# EAGLE design ESPBoost (EAGLE 9.6.1)
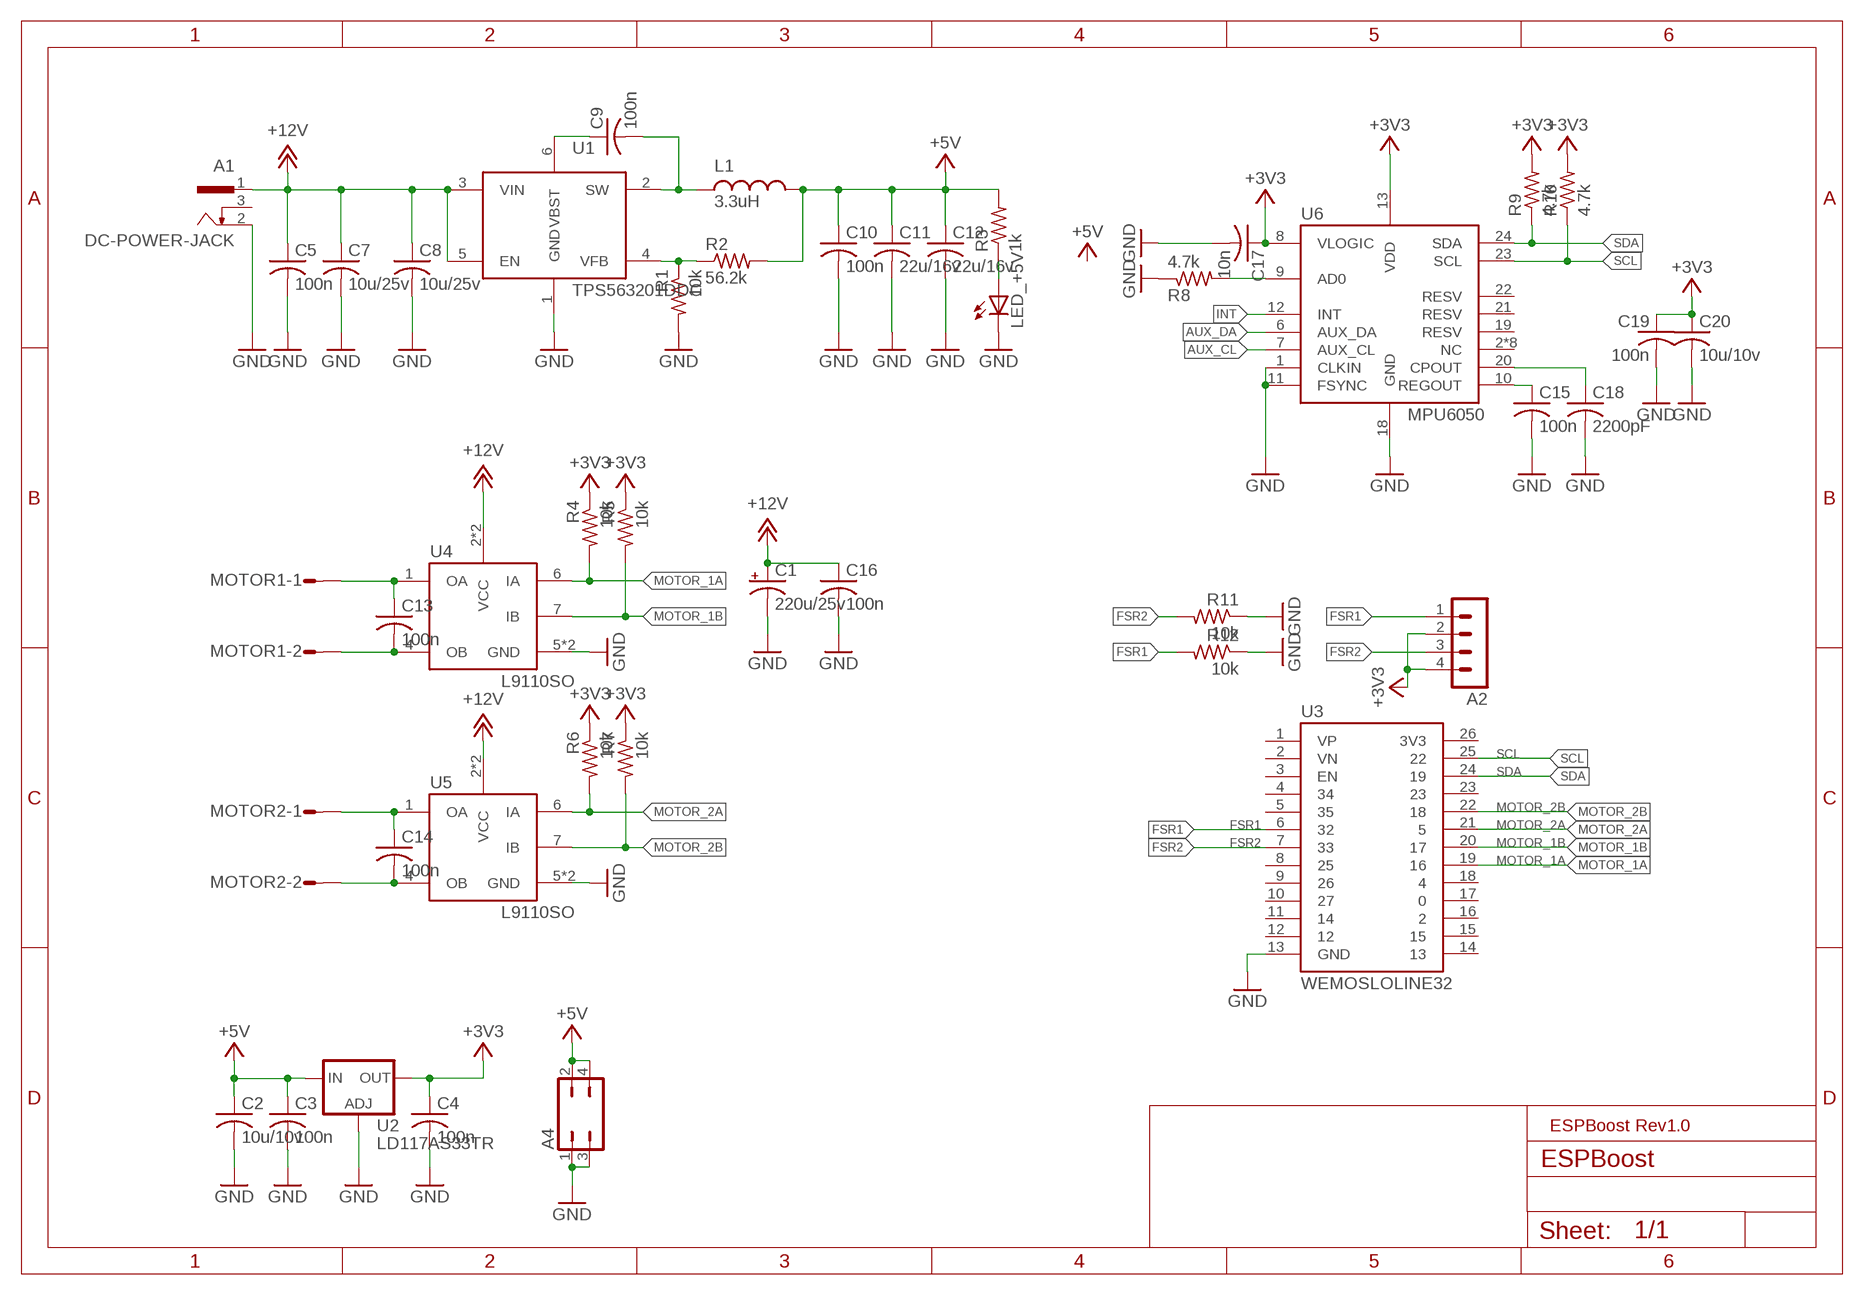
[diagram p0: schematic, sheet 1]

## Parts
A1  DC-POWER-JACK  [DC-POWER]
A2  MA04-1  [MA04-1]
A4  JP2Q  [JP2Q]
C1  220u/25v  CPOL-USE3.5-8  [E3,5-8]
C2  10u/10v  C-USC0805  [C0805]
C3  100n  C-USC0805  [C0805]
C4  100n  C-USC0805  [C0805]
C5  100n  C-USC0805  [C0805]
C7  10u/25v  C-USC1206  [C1206]
C8  10u/25v  C-USC1206  [C1206]
C9  100n  C-USC0805  [C0805]
C10  100n  C-USC0805  [C0805]
C11  22u/16v  C-USC1206  [C1206]
C12  22u/16v  C-USC1206  [C1206]
C13  100n  C-USC0805  [C0805]
C14  100n  C-USC0805  [C0805]
C15  100n  C-USC0805  [C0805]
C16  100n  C-USC0805  [C0805]
C17  10n  C-USC0805  [C0805]
C18  2200pF  C-USC0805  [C0805]
C19  100n  C-USC0805  [C0805]
C20  10u/10v  C-USC0805  [C0805]
L1  3.3uH  SL7032  [SLF7032TYPE]
LED_+5V  LEDCHIPLED_0805  [CHIPLED_0805]
MOTOR1  S02P  [S02P]
MOTOR2  S02P  [S02P]
R1  10k  R-US_R0805  [R0805]
R2  56.2k  R-US_R0805  [R0805]
R3  1k  R-US_R0805  [R0805]
R4  10k  R-US_R0805  [R0805]
R5  10k  R-US_R0805  [R0805]
R6  10k  R-US_R0805  [R0805]
R7  10k  R-US_R0805  [R0805]
R8  4.7k  R-US_R0805  [R0805]
R9  4.7k  R-US_R0805  [R0805]
R10  4.7k  R-US_R0805  [R0805]
R11  10k  R-US_R0805  [R0805]
R12  10k  R-US_R0805  [R0805]
U1  TPS563201DDC  [SOT23-6L]
U2  LD117AS33TR  [SOT223]
U3  WEMOSLOLINE32  [WEMOSLOLIN32]
U4  L9110SO  [SO08]
U5  L9110SO  [SO08]
U6  MPU6050  [QFN24]

## Nets
+3V3 [16mil]: A2.2 A2.4 C4.1 C17.1 C19.1 C20.1 R4.1 R5.1 R6.1 R7.1 R9.2 R10.2 U2.4(OUT) U6.8(VLOGIC) U6.13(VDD)
+5V [32mil]: A4.2 A4.4 C2.1 C3.1 C10.1 C11.1 C12.1 L1.2 R2.2 R3.2 U2.3(IN)
+12V [32mil]: A1.1 C1.+ C5.1 C7.1 C8.1 C16.1 U1.3(VIN) U1.5(EN) U4.2(VCC) U4.3(VCC) U5.2(VCC) U5.3(VCC)
AUX_CL: U6.7(AUX_CL)
AUX_DA: U6.6(AUX_DA)
FSR1: A2.1 R12.2 U3.6
FSR2: A2.3 R11.2 U3.7
GND: A1.2 A4.1 A4.3 C1.- C2.2 C3.2 C4.2 C5.2 C7.2 C8.2 C10.2 C11.2 C12.2 C15.2 C16.2 C17.2 C18.2 C19.2 C20.2 LED_+5V.C R1.2 R8.1 R11.1 R12.1 U1.1(GND) U2.1(ADJ) U3.13(GND) U4.5(GND) U4.8(GND) U5.5(GND) U5.8(GND) U6.1(CLKIN) U6.11(FSYNC) U6.18(GND)
INT: U6.12(INT)
MOTOR_1A: R4.2 U3.19 U4.6(IA)
MOTOR_1B: R5.2 U3.20 U4.7(IB)
MOTOR_1OA: C13.1 MOTOR1.1 U4.1(OA)
MOTOR_1OB: C13.2 MOTOR1.2 U4.4(OB)
MOTOR_2A: R6.2 U3.21 U5.6(IA)
MOTOR_2B: R7.2 U3.22 U5.7(IB)
MOTOR_2OA: C14.1 MOTOR2.1 U5.1(OA)
MOTOR_2OB: C14.2 MOTOR2.2 U5.4(OB)
N$19: LED_+5V.A R3.1
N$23: C9.2 L1.1 U1.2(SW)
N$25: R1.1 R2.1 U1.4(VFB)
N$27: C9.1 U1.6(VBST)
N$31: R8.2 U6.9(AD0)
N$32: C15.1 U6.10(REGOUT)
N$33: C18.1 U6.20(CPOUT)
SCL: R10.1 U3.25 U6.23(SCL)
SDA: R9.1 U3.24 U6.24(SDA)
Unconnected: A1.3 U3.1(VP) U3.2(VN) U3.3(EN) U3.4 U3.5 U3.8 U3.9 U3.10 U3.11 U3.12 U3.14 U3.15 U3.16 U3.17 U3.18 U3.23 U3.26(3V3) U6.2(NC) U6.3(NC) U6.4(NC) U6.5(NC) U6.14(NC) U6.15(NC) U6.16(NC) U6.17(NC) U6.19(RESV) U6.21(RESV) U6.22(RESV)

## Notes on the sheet
- ESPBoost Rev1.0

## Library data of the parts
A1 = mylib:DC-POWER-JACK
A2 = mylib:MA04-1: PIN HEADER; OC_FARNELL: unknown; OC_NEWARK: unknown
A4 = jumper:JP2Q: JUMPER
C1 = rcl:CPOL-US: POLARIZED CAPACITOR, American symbol; SPICEPREFIX: C
C2-C5 C7-C20 = rcl:C-US: CAPACITOR, American symbol; SPICEPREFIX: C
L1 = mylib:SL7032
LED_+5V = led:LED: LED OSRAM: - CHIPLED LG R971, LG N971, LY N971, LG Q971, LY Q971, LO R971, LY R971 LH N974, LH R974 LS Q976, LO Q976, LY Q976 LO Q996 - Hyper CHIPLED LW Q18S LB Q993, LB Q99A, LB R99A - SideLED LS A670, LO A670, LY A670, LG A670, LP A670 LB A673, LV A673, LT A673, LW A673 LH A674 LY A675 LS A676, LA A676, LO A676, LY A676, LW A676 LS A679, LY A679, LG A679 - Hyper Micro SIDELED® LS Y876, LA Y876, LO Y876, LY Y876 LT Y87S - SmartLED LW L88C, LW L88S LB L89C, LB L89S, LG L890 LS L89K, LO L89K, LY L89K LS L896, LA L896, LO L896, LY L896 - TOPLED LS T670, LO T670, LY T670, LG T670, LP T670 LSG T670, LSP T670, LSY T670, LOP T670, LYG T670 LG T671, LOG T671, LSG T671 LB T673, LV T673, LT T673, LW T673 LH T674 LS T676, LA T676, LO T676, LY T676, LB T676, LH T676, LSB T676, LW T676 LB T67C, LV T67C, LT T67C, LS T67K, LO T67K, LY T67K, LW E67C LS E67B, LA E67B, LO E67B, LY E67B, LB E67C, LV E67C, LT E67C LW T67C LS T679, LY T679, LG T679 LS T770, LO T770, LY T770, LG T770, LP T770 LB T773, LV T773, LT T773, LW T773 LH T774 LS E675, LA E675, LY E675, LS T675 LS T776, LA T776, LO T776, LY T776, LB T776 LHGB T686 LT T68C, LB T68C - Hyper Mini TOPLED® LB M676 - Mini TOPLED Santana® LG M470 LS M47K, LO M47K, LY M47K Source: http://www.osram.convergy.de LUXEON: - LUMILED® LXK2-PW12-R00, LXK2-PW12-S00, LXK2-PW14-U00, LXK2-PW14-V00 LXK2-PM12-R00, LXK2-PM12-S00, LXK2-PM14-U00 LXK2-PE12-Q00, LXK2-PE12-R00, LXK2-PE12-S00, LXK2-PE14-T00, LXK2-PE14-U00 LXK2-PB12-K00, LXK2-PB12-L00, LXK2-PB12-M00, LXK2-PB14-N00, LXK2-PB14-P00, LXK2-PB14-Q00 LXK2-PR12-L00, LXK2-PR12-M00, LXK2-PR14-Q00, LXK2-PR14-R00 LXK2-PD12-Q00, LXK2-PD12-R00, LXK2-PD12-S00 LXK2-PH12-R00, LXK2-PH12-S00 LXK2-PL12-P00, LXK2-PL12-Q00, LXK2-PL12-R00 Source: www.luxeon.com KINGBRIGHT: KA-3528ASYC Source: www.kingbright.com
MOTOR1 MOTOR2 = con-amp-mt:S02P: AMP MT CONNECTOR; OC_FARNELL: unknown; OC_NEWARK: unknown
R1-R12 = rcl:R-US_: RESISTOR, American symbol; SPICEPREFIX: R
U1 = mylib:TPS563201: TPS56320x 采用6引脚SOT-23 封装的4.5V 至17V 输入、3A 同步降压稳压器 TPS56220x 采用6引脚SOT-23 封装的4.5V 至17V 输入、2A 同步降压稳压器 二者pin对pin，仅仅输出电流不一致。
U2 = v-reg:LD117A?*: Low drop fixed and adjustable positive voltage regulators 1 A Source: http://www.st.com/stonline/products/literature/ds/7194/ld1117axx.pdf
U3 = mylib:WEMOSLOLINE32: ESP32开发测试模块WEMOSLOLINE32LITE
U4 U5 = mylib:L9110: L9110B 是为控制和驱动电机设计的两通道 推挽式功率放大专用集成电路器件,每通道能通过750~800mA 的持续电流，峰值电流能力可达1.5~2.0A
U6 = mylib:MPU6050

## Net classes
0 12mil: width 0.305 mm, drill 0.3 mm, clearance 0.203 mm
1 32mil: width 0.813 mm, drill 0.5 mm, clearance 0.203 mm
2 10mil: width 0.254 mm, drill 0.3 mm, clearance 0.203 mm
3 16mil: width 0.406 mm, drill 0.3 mm, clearance 0.203 mm
4 24mil: width 0.61 mm, drill 0.4 mm, clearance 0.203 mm

## Board
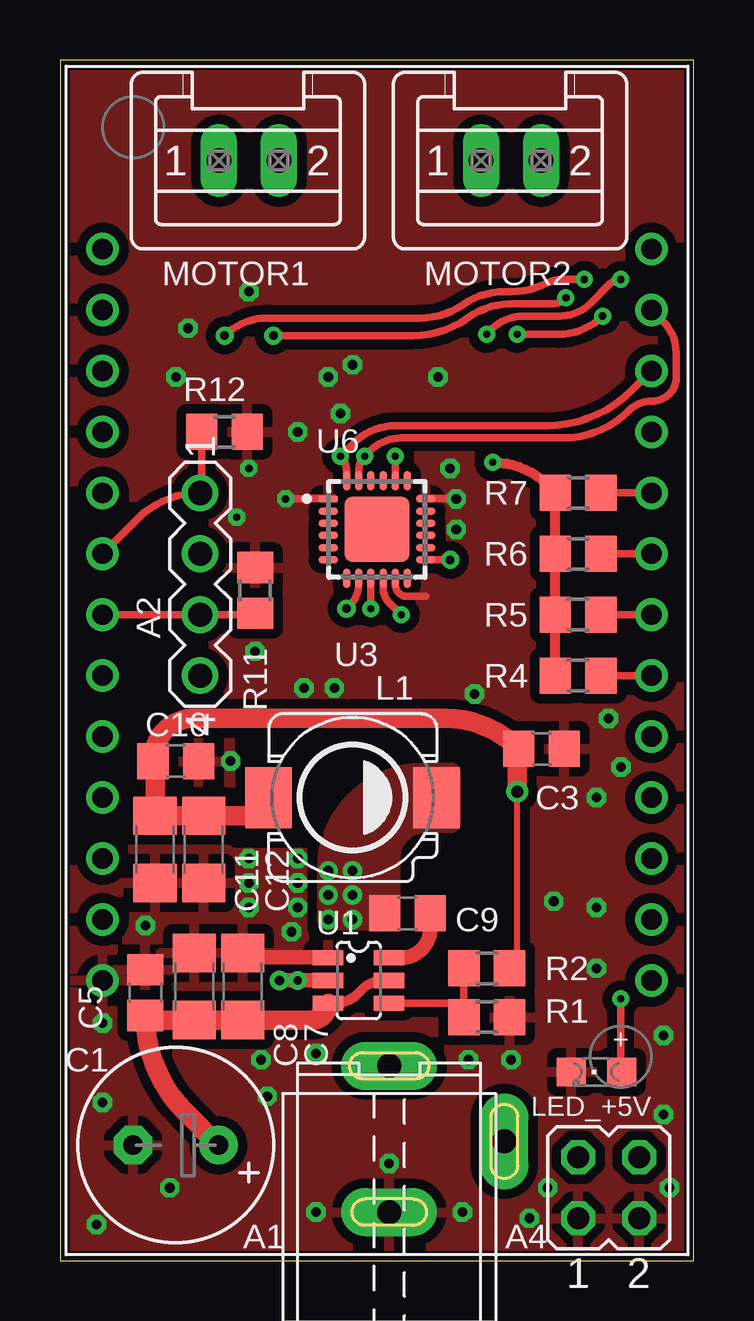
[diagram p1: board, top side]
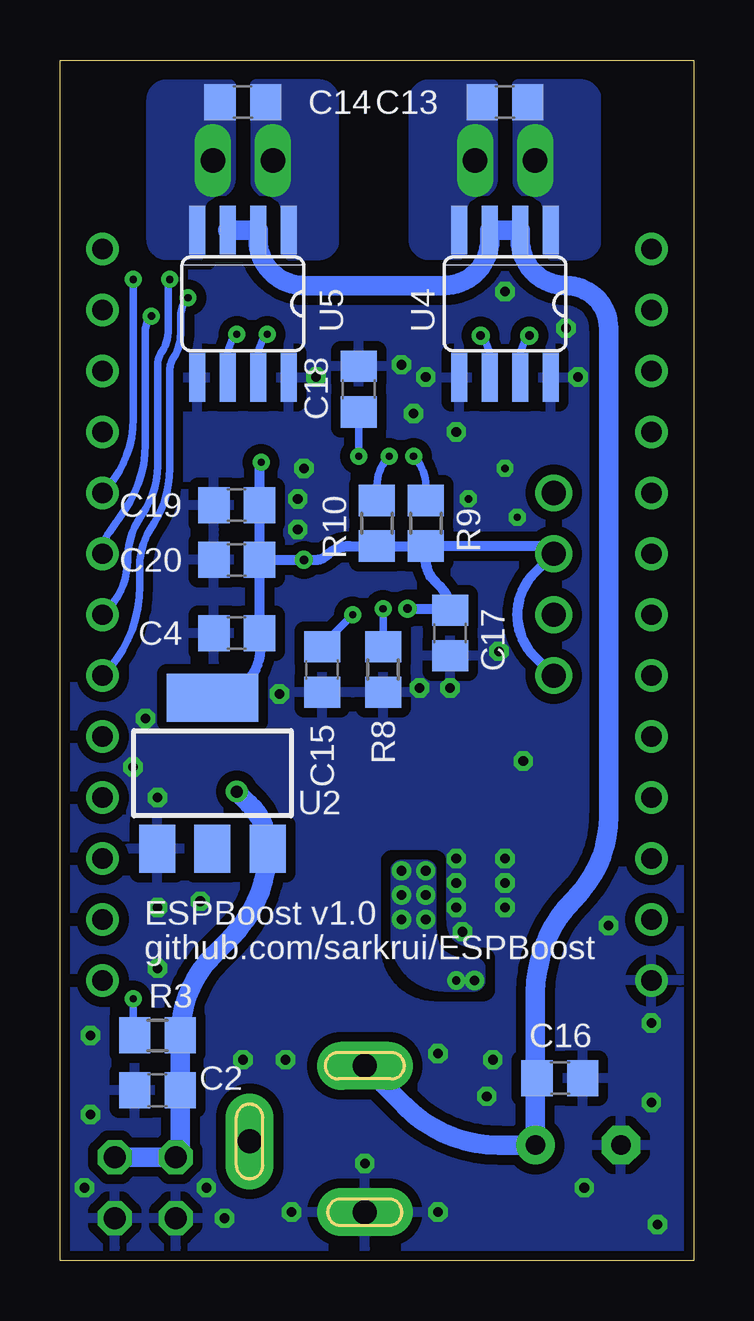
[diagram p2: board, bottom side, seen from below]

Size 26.42 x 50.04 mm. Coordinates in mm from the lower left corner, seen from the top.
Outline: 0,0 26.42,0 26.42,50.04 0,50.04 0,0
Copper layers (1*16): Top 0.035mm / dielectric 1.5mm / Bottom 0.035mm
Design rules "default *": minimum track width 10mil, minimum drill 0.3mm, track to track 6mil, track to pad 6mil, pad to pad 6mil, via to via 6mil, smd to smd 6mil, copper to edge 10mil, drill to drill 6mil, minimum pad ring 10mil, minimum via ring 8mil, stop-mask expansion 4mil, vias tented up to drill 20mil, thermal gap 16mil
tRestrict: 3 lines

### Footprints (pad centres in the part's own frame; a part is rotated, then mirrored left to right if it is on the bottom)
DC-POWER = drill 1 pad 2 long: 1 0,3.048; 2 0,-3.048; 3 4.8,-0.1
MA04-1 = drill 1.016: 1 -3.81,0; 2 -1.27,0; 3 1.27,0; 4 3.81,0
JP2Q = drill 0.914 octagon: 1 -1.27,-1.27; 2 -1.27,1.27; 3 1.27,-1.27; 4 1.27,1.27
E3,5-8 = drill 0.813 pad 1.6: + -1.778,0 | drill 0.813 pad 1.6 octagon: - 1.778,0
C0805 = smd 1.3 x 1.5: 1 -0.95,0; 2 0.95,0
C1206 = smd 1.6 x 1.8: 1 -1.4,0; 2 1.4,0
SLF7032TYPE = smd 1.93 x 2.54: 1 -3.5,0; 2 3.5,0
CHIPLED_0805 = smd 1.2 x 1.2: A 0,-1.05; C 0,1.05
S02P = drill 1.016 long: 1 1.25,0; 2 -1.25,0
R0805 = smd 1.3 x 1.5: 1 -0.95,0; 2 0.95,0
SOT23-6L = smd 0.635 x 1.27: 1 -0.95,-1.27; 2 0,-1.27; 3 0.95,-1.27; 4 0.95,1.27; 5 0,1.27; 6 -0.95,1.27
SOT223 = smd 1.5 x 2: 1 -2.3,-3.15; 2 0,-3.15; 3 2.3,-3.15 | smd 3.8 x 2: 4 0,3.15
WEMOSLOLIN32 = drill 0.85: 1 -11.43,15.24; 2 -11.43,12.7; 3 -11.43,10.16; 4 -11.43,7.62; 5 -11.43,5.08; 6 -11.43,2.54; 7 -11.43,0; 8 -11.43,-2.54; 9 -11.43,-5.08; 10 -11.43,-7.62; 11 -11.43,-10.16; 12 -11.43,-12.7; 13 -11.43,-15.24; 14 11.43,-15.24; 15 11.43,-12.7; 16 11.43,-10.16; 17 11.43,-7.62; 18 11.43,-5.08; 19 11.43,-2.54; 20 11.43,0; 21 11.43,2.54; 22 11.43,5.08; 23 11.43,7.62; 24 11.43,10.16; 25 11.43,12.7; 26 11.43,15.24
SO08 = smd 0.66 x 2.032: 1 -1.905,-3.073; 2 -0.635,-3.073; 3 0.635,-3.073; 4 1.905,-3.073; 5 1.905,3.073; 6 0.635,3.073; 7 -0.635,3.073; 8 -1.905,3.073
QFN24 = smd 0.813 x 0.305: 1 -2.032,1.27; 2 -2.032,0.762; 3 -2.032,0.254; 4 -2.032,-0.254; 5 -2.032,-0.762; 6 -2.032,-1.27; 13 2.032,-1.27; 14 2.032,-0.762; 15 2.032,-0.254; 16 2.032,0.254; 17 2.032,0.762; 18 2.032,1.27 | smd 0.305 x 0.813: 7 -1.27,-2.032; 8 -0.762,-2.032; 9 -0.254,-2.032; 10 0.254,-2.032; 11 0.762,-2.032; 12 1.27,-2.032; 19 1.27,2.032; 20 0.762,2.032; 21 0.254,2.032; 22 -0.254,2.032; 23 -0.762,2.032; 24 -1.27,2.032 | smd 2.718 x 2.718: 25 0,0

### Placement (x,y rotation side)
A1  13.72,5.08 0 top
A2  5.84,28.19 270 top
A4  22.86,3.05 0 top
C1  4.83,4.83 180 top
C2  22.35,7.11 180 bottom
C3  20.07,21.34 0 top
C4  19.05,26.16 180 bottom
C5  3.56,11.18 90 top
C7  7.62,11.43 90 top
C8  5.59,11.43 90 top
C9  14.48,14.48 180 top
C10  4.83,20.83 0 top
C11  3.96,17.15 270 top
C12  5.99,17.15 270 top
C13  7.87,48.29 180 bottom
C14  18.8,48.29 180 bottom
C15  15.49,24.64 270 bottom
C16  5.59,7.62 0 bottom
C17  10.16,26.16 270 bottom
C18  13.97,36.32 90 bottom
C19  19.05,31.5 180 bottom
C20  19.05,29.21 180 bottom
L1  12.19,19.3 180 top
LED_+5V  22.35,7.87 90 top
MOTOR1  7.87,45.85 180 top
MOTOR2  18.8,45.85 180 top
R1  17.78,10.16 0 top
R2  17.78,12.19 0 top
R3  22.35,9.4 0 bottom
R4  21.59,24.38 0 top
R5  21.59,26.92 0 top
R6  21.59,29.46 0 top
R7  21.59,32 0 top
R8  12.95,24.64 90 bottom
R9  11.18,30.73 270 bottom
R10  13.21,30.73 270 bottom
R11  8.13,27.94 270 top
R12  6.86,34.54 180 top
U1  12.45,11.68 270 top
U2  20.07,20.32 0 bottom
U3  13.21,26.92 0 top
U4  7.87,39.88 180 bottom
U5  18.8,39.88 180 bottom
U6  13.21,30.48 0 top

### Tracks (layer width: path | path; a pad name or v marks a point on that pad's centre or on a via)
+3V3  (via drill 0.3, 0.35)
  Top 0.305: U6.8 12.45,28.23 arc-45 12.06,27.3 v11.94,27.18 | U6.13 v16.26,29.21
  Top 0.406: R4.1 R5.1 R6.1 R7.1 20.32,32.33 arc45 v18.03,33.27
  Bottom 0.406: R9.2 R10.2 14.36,29.78 arc-45 15.31,29.39 arc45 15.75,29.21 v16.26,29.21 C20.1 | U2.4 19.2,23.47 18.8,23.88 arc-45 18.03,25.72 18.03,26.1 C4.1 C20.1 | C20.1 C19.1 18.1,33.12 arc45 v18.03,33.27 | v11.94,27.18 10.23,27.18 C17.1 arc-45 10.57,28.09 10.79,28.32 arc45 11.18,29.24 R9.2 | R9.2 6.62,29.78 arc45 A2.2 6.65,28.66 arc-45 7.37,26.92 arc-45 6.65,25.19 A2.4
+5V  (via drill 0.5)
  Top 0.254: 19.05,12.51 v19.05,19.56
  Top 0.305: R2.2 19.05,12.51
  Top 0.813: L1.2 8.69,18.55 C12.1 C11.1 3.96,20.74 C10.1 3.88,20.9 arc-90 5.59,22.61 16.04,22.61 arc-45 C3.1 19.05,21.27 v19.05,19.56
  Bottom 0.813: A4.4 A4.2 21.4,4.51 C2.1 R3.2 arc45 20.01,12.75 19.3,13.47 arc-45 U2.3 arc-45 18.55,19.05 v19.05,19.56
+12V
  Top 0.406: U1.3 11.43,10.73 arc45 12.41,11.14 12.6,11.32 arc-45 13.46,11.68 U1.5
  Top 0.813: C1.+ 5.22,6.21 arc-45 C5.1 3.56,10.03 C8.1 C7.1 10.47,10.03 arc90 U1.3
  Bottom 0.813: 6.6,7.62 C1.+ 8.13,4.83 arc45 12.03,6.44 A1.1 | 6.6,7.62 C16.1 | U5.3 U5.2 18.16,42.55 arc-90 16.26,40.64 10.41,40.64 arc-90 8.51,42.55 U4.3 U4.2 7.24,42.55 arc-90 5.33,40.64 arc90 3.56,38.86 3.56,18.54 arc45 4.99,15.08 arc-45 6.6,11.18 6.6,7.62
FSR1
  Top 0.305: U3.6 3.24,30.93 arc-45 A2.1 5.91,32.07 R12.2
FSR2
  Top 0.305: U3.7 A2.3 8.06,26.92 R11.2
GND  (via drill 0.3, 0.4)
  Top 0.305: U6.11 13.97,28.19 arc45 14.12,27.84 arc45 14.48,27.69 15.24,27.69 | U6.1 v9.4,31.75 | U6.18 16.26,31.75
  Top 0.61: U1.1 10.87,12.63 10.87,12.65 7.62,12.65 C7.2
  other vias: 22.86,22.61 11.43,23.88 17.27,23.62 22.35,14.73 23.37,20.57 25.15,9.4 25.4,3.05 19.56,1.78 20.32,3.05 16.76,2.03 13.72,4.06 10.67,2.03 9.65,13.72 7.87,14.73 3.56,13.97 1.78,9.91 1.78,6.6 4.57,3.05 1.52,1.52 8.64,6.86 10.67,8.64 18.8,8.38 17.02,8.38 22.35,19.3 7.11,20.83 9.91,14.73 9.91,16.76 7.87,16.76 7.87,15.75 9.91,15.75 8.38,8.38 25.15,6.1 20.57,14.99 22.35,12.19 16.51,31.75 16.51,30.48 16.26,33.02 15.75,36.83 12.19,37.34 11.18,36.83 4.83,36.83 11.68,35.31 9.91,34.54 5.33,38.86 7.37,30.99 7.87,33.02 10.16,23.88 8.13,25.4 7.87,40.39
  pour Top (isolate 0.406, rank 2): 0,0 0,50.04 26.42,50.04 26.42,0
  pour Bottom (isolate 0.406, rank 2): 0,0 28.45,0 28.45,50.04 0,50.04
MOTOR_1A  (via drill 0.3, 0.35)
  Top 0.305: v21.08,40.13 arc-45 20.47,39.88 18.8,39.88 arc36 16.98,39.29 arc-36 14.7,38.55 v8.89,38.55 | R4.2 U3.19
  Bottom 0.305: v21.08,40.13 arc-45 21.39,39.39 21.39,38.63 arc33 21.68,37.66 arc-33 21.84,37.08 21.84,33.02 arc32 22.49,30.75 22.66,30.48 arc-32 23.09,28.96 23.09,28.11 arc45 U3.19 | U4.6 8.51,37.63 arc-45 v8.89,38.55
MOTOR_1B  (via drill 0.3, 0.35)
  Top 0.305: v21.84,40.89 20.95,40.89 arc27 20.27,40.73 arc-27 18.8,40.39 18.54,40.39 arc34 16.79,39.84 arc-34 14.99,39.29 8.63,39.29 arc45 v6.86,38.55 | R5.2 U3.20
  Bottom 0.305: v21.84,40.89 arc-45 21.9,40.77 21.9,38.82 arc33 22.17,37.89 arc-33 22.35,37.27 22.35,33.13 arc35 23,31.09 arc-35 23.6,29.21 arc45 24.49,27.07 U3.20 | U4.7 7.24,37.63 arc45 v6.86,38.55
MOTOR_1OA
  pour Bottom (isolate 0.406, no thermals): 4.06,42.55 4.06,48.39 arc-90 4.7,49.02 7.37,49.02 7.37,45.09 arc-90 6.73,44.45 arc90 6.1,43.81 6.1,41.91 4.7,41.91 arc-90
MOTOR_1OB
  pour Bottom (isolate 0.406, no thermals): 8.38,49.02 8.38,45.09 arc90 9.02,44.45 arc-90 9.65,43.81 9.65,41.91 11.05,41.91 arc90 11.68,42.55 11.68,48.39 arc90 11.05,49.02
MOTOR_2A  (via drill 0.3)
  Top 0.305: v22.61,39.37 arc-45 20.77,38.61 v19.05,38.61 | R6.2 U3.21
  Bottom 0.305: v22.61,39.37 arc-45 22.86,38.76 22.86,34.04 arc35 23.73,31.26 24.35,30.39 arc-35 U3.21 | U5.6 19.43,37.69 arc45 v19.05,38.61
MOTOR_2B  (via drill 0.3)
  Top 0.305: R7.2 U3.22 | v23.37,40.89 arc45 22.91,40.7 22.11,39.9 arc-45 20.83,39.37 19.81,39.37 19.3,39.37 arc45 18,38.83 v17.78,38.61
  Bottom 0.305: U5.7 18.16,37.69 arc45 v17.78,38.61 | U3.22 arc-45 23.37,35.07 v23.37,40.89
MOTOR_2OA
  pour Bottom (isolate 0.406, no thermals): 17.02,41.91 15.62,41.91 arc-90 14.99,42.55 14.99,48.39 arc-90 15.62,49.02 18.29,49.02 18.29,45.09 arc-90 17.65,44.45 arc90 17.02,43.81
MOTOR_2OB
  pour Bottom (isolate 0.406, no thermals): 19.3,49.02 19.3,45.09 arc90 19.94,44.45 arc-90 20.57,43.81 20.57,41.91 21.97,41.91 arc90 22.61,42.55 22.61,48.39 arc90 21.97,49.02
N$19  (via drill 0.3)
  Top 0.305: LED_+5V.A 23.37,7.91 v23.37,10.92
  Bottom 0.305: v23.37,10.92 23.37,9.46 R3.1
N$23  (via drill 0.35, 0.4)
  Top 0.61: U1.2 v9.91,11.68 v9.14,11.68
  other vias: 11.18,16.26 12.19,16.26 11.18,15.24 12.19,15.24 11.18,14.22 12.19,14.22
  pour Top (isolate 0.406, no thermals): 13.97,13.97 11.18,13.97 arc-90 10.92,14.22 10.92,16.33 arc-90 15.16,20.57 16.26,20.57 arc-90 16.51,20.32 16.51,18.29 arc-90 16.26,18.03 15.24,18.03 arc90 13.97,16.76
  pour Bottom (isolate 0.406): 10.92,13.72 10.92,16.26 arc-90 11.18,16.51 12.19,16.51 arc-90 12.45,16.26 12.45,13.46 arc-90 10.41,11.43 9.14,11.43 arc-90 8.89,11.68 8.89,12.19 arc-90 9.14,12.45 9.65,12.45 arc90
N$25
  Top 0.305: U1.4 16.26,10.73 R1.1 R2.1
N$27
  Top 0.61: U1.6 14.22,12.63 arc90 15.43,13.84 C9.1
N$31  (via drill 0.3)
  Top 0.305: U6.9 v12.95,27.18
  Bottom 0.305: v12.95,27.18 R8.2
N$32  (via drill 0.3)
  Top 0.305: U6.10 13.46,28.05 arc45 13.72,27.43 v14.22,26.92
  Bottom 0.305: C15.1 15.49,25.65 v14.22,26.92
N$33  (via drill 0.3)
  Top 0.305: U6.20 v13.97,33.53
  Bottom 0.305: v13.97,33.53 C18.1
SCL  (via drill 0.3)
  Top 0.305: U6.23 12.45,32.91 arc-45 v12.7,33.53 12.92,33.75 arc-45 14.22,34.29 20.96,34.29 arc45 23.7,35.42 arc-45 24.64,35.81 arc45 25.4,36.13 arc45 25.67,36.78 25.67,37.85 arc45 25.15,39.12 U3.25
  Bottom 0.305: v12.7,33.53 arc-45 13.21,32.3 R10.1
SDA  (via drill 0.3)
  Top 0.305: U6.24 11.94,32.91 arc45 v11.68,33.53 12.24,34.08 arc-45 13.97,34.8 20.26,34.8 arc45 23.83,36.27 U3.24
  Bottom 0.305: v11.68,33.53 arc45 11.18,32.3 R9.1

### Text on the board
bPlace: ESPBoost v1.0 / github.com/sarkrui/ESPBoost